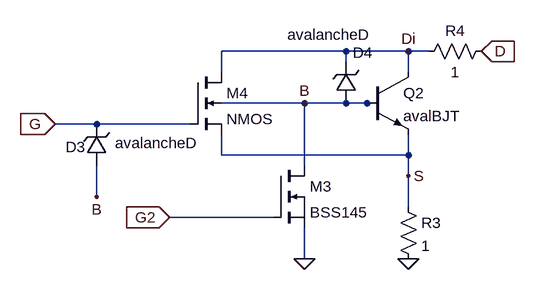
[diagram p0: schematic NeuronSubCirc.asc]
NeuronSubCirc.asc, the LTspice schematic file:
Version 4
SHEET 1 1080 680
WIRE 224 32 32 32
WIRE 320 32 224 32
WIRE 352 32 320 32
WIRE 224 48 224 32
WIRE 32 64 32 32
WIRE 320 64 320 32
WIRE 160 112 32 112
WIRE 224 112 160 112
WIRE 256 112 224 112
WIRE 272 112 256 112
WIRE -160 144 -224 144
WIRE -16 144 -160 144
WIRE 32 192 32 160
WIRE 320 192 320 160
WIRE 320 192 32 192
WIRE 160 208 160 112
WIRE 320 224 320 192
WIRE -160 256 -160 208
WIRE 320 272 320 224
WIRE 112 288 -48 288
WIRE 160 352 160 304
FLAG -224 144 G
IOPIN -224 144 In
FLAG 432 32 D
IOPIN 432 32 In
FLAG 320 352 0
FLAG 160 112 B
FLAG 320 224 S
FLAG 320 32 Di
FLAG 160 352 0
FLAG -160 256 B
FLAG -48 288 G2
IOPIN -48 288 In
SYMBOL npn 256 64 R0
SYMATTR InstName Q2
SYMATTR Value avalBJT
SYMATTR Value2 area=0.1
SYMBOL res 304 256 R0
SYMATTR InstName R3
SYMATTR Value 1
SYMBOL res 448 16 R90
WINDOW 0 0 56 VBottom 2
WINDOW 3 32 56 VTop 2
SYMATTR InstName R4
SYMATTR Value 1
SYMBOL zener -144 208 R180
WINDOW 0 33 29 Left 2
WINDOW 3 -140 35 Left 2
SYMATTR InstName D3
SYMATTR Value avalancheD
SYMBOL zener 240 112 R180
WINDOW 0 -25 78 Left 2
WINDOW 3 -21 106 Left 2
SYMATTR InstName D4
SYMATTR Value avalancheD
SYMATTR SpiceLine area=0.01
SYMBOL nmos 112 208 R0
SYMATTR InstName M3
SYMATTR Value BSS145
SYMBOL nmos4 -16 64 R0
SYMATTR InstName M4
SYMATTR Value2 l='Ln' w='Wn' m=10

The netlist it stands for:
* NeuronSubCirc.asc
Q2 Di B S 0 avalBJT area=0.1
R3 S 0 1
R4 D Di 1
D3 B G avalancheD
D4 B Di avalancheD area=0.01
M3 B G2 0 0 BSS145
M4 Di G S B NMOS l='Ln' w='Wn' m=10
.model D D
.lib standard.dio
.model NPN NPN
.model PNP PNP
.lib standard.bjt
.model NMOS NMOS
.model PMOS PMOS
.lib standard.mos
.backanno
.end